# Altium schematic sheet top_Squad.SchDoc
size A4; SheetNumber: 1; SheetTotal: 7
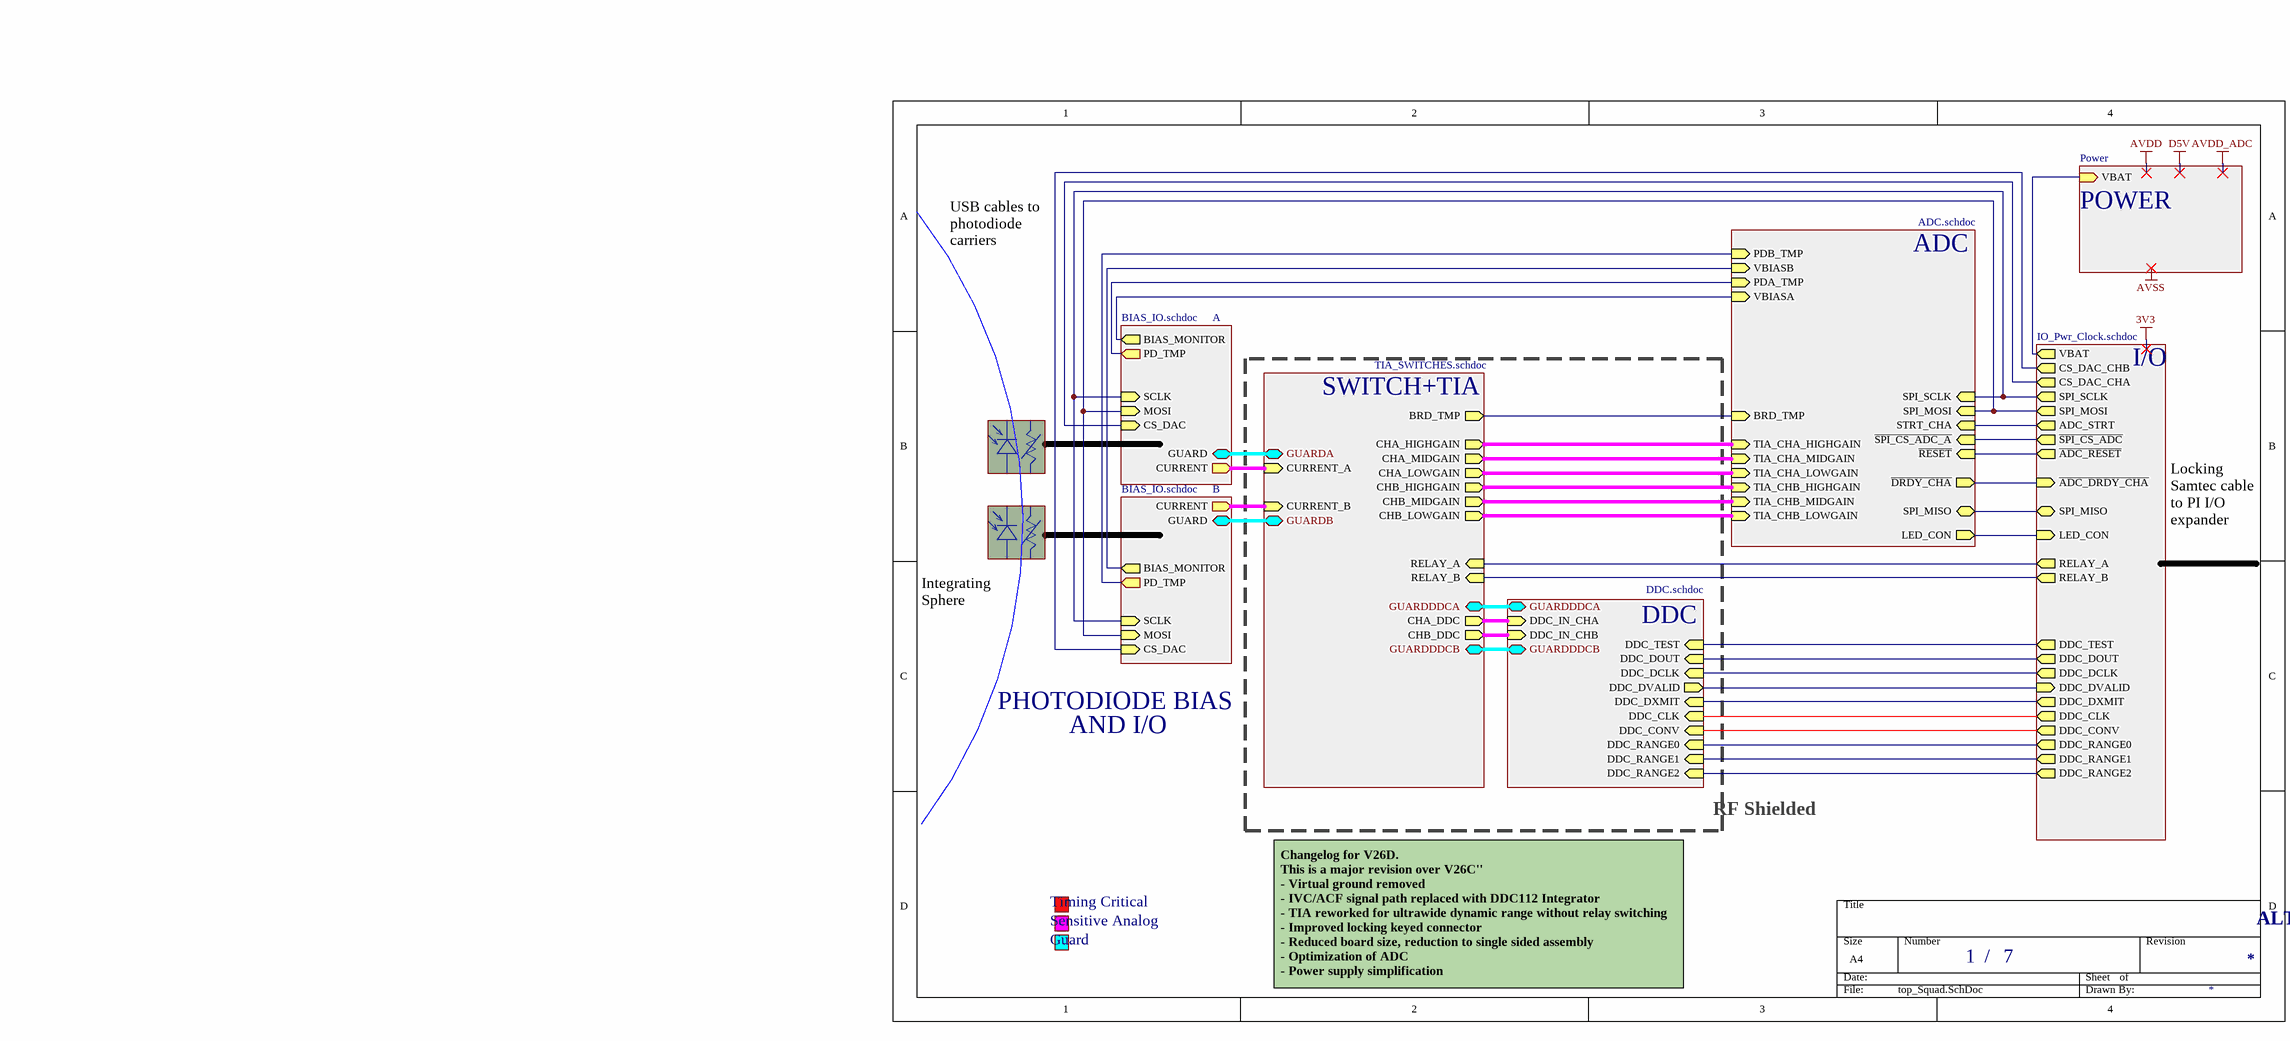
[diagram p0: top_Squad.SchDoc]

## Sub-sheets
A = BIAS_IO.schdoc: CURRENT (out), GUARD (bidir), BIAS_MONITOR (out), PD_TMP (out), SCLK (in), MOSI (in), CS_DAC (in)
ADC = ADC.schdoc: SPI_MISO (bidir), ~{DRDY_CHA} (out), ~{RESET} (in), ~{SPI_CS_ADC_A} (in), STRT_CHA (in), TIA_CHB_LOWGAIN (in), TIA_CHB_MIDGAIN (in), TIA_CHB_HIGHGAIN (in), TIA_CHA_LOWGAIN (in), TIA_CHA_MIDGAIN (in), TIA_CHA_HIGHGAIN (in), BRD_TMP (in), LED_CON (out), VBIASA (in), PDA_TMP (in), SPI_MOSI (in), SPI_SCLK (in), VBIASB (in), PDB_TMP (in)
B = BIAS_IO.schdoc: CURRENT (out), GUARD (bidir), MOSI (in), SCLK (in), CS_DAC (in), BIAS_MONITOR (out), PD_TMP (out)
DDC = DDC.schdoc: DDC_CONV (in), DDC_CLK (in), DDC_IN_CHA (in), DDC_IN_CHB (in), DDC_RANGE2 (in), DDC_RANGE0 (in), DDC_RANGE1 (in), DDC_DXMIT (in), DDC_DVALID (out), DDC_DCLK (in), DDC_DOUT (in), DDC_TEST (in), GUARDDDCA (bidir), GUARDDDCB (bidir)
I/O = IO_Pwr_Clock.schdoc: DDC_RANGE2 (out), DDC_RANGE1 (out), DDC_RANGE0 (out), DDC_CONV (out), DDC_CLK (out), DDC_DXMIT (out), DDC_DVALID (in), DDC_DCLK (out), DDC_DOUT (out), DDC_TEST (out), RELAY_A (out), RELAY_B (out), ~{ADC_DRDY_CHA} (in), ~{SPI_CS_ADC} (out), ~{ADC_RESET} (out), SPI_MISO (bidir), ADC_STRT (out), CS_DAC_CHA (out), VBAT (out), CS_DAC_CHB (out), LED_CON (in), SPI_MOSI (out), SPI_SCLK (out)
POWER = Power: VBAT (in)
SWITCH+TIA = TIA_SWITCHES.schdoc: CHB_HIGHGAIN (out), CHB_MIDGAIN (out), CHB_LOWGAIN (out), CHA_LOWGAIN (out), CHA_MIDGAIN (out), CHA_HIGHGAIN (out), CURRENT_A (in), CURRENT_B (in), CHB_DDC (out), CHA_DDC (out), RELAY_B (in), RELAY_A (in), GUARDDDCA (bidir), GUARDDDCB (bidir), GUARDB (bidir), GUARDA (bidir), BRD_TMP (out)

## Nets
(unnamed): sheet POWER/VBAT, sheet I/O/VBAT
(unnamed): sheet I/O/DDC_RANGE2, sheet DDC/DDC_RANGE2
(unnamed): sheet I/O/DDC_RANGE1, sheet DDC/DDC_RANGE1
(unnamed): sheet I/O/DDC_RANGE0, sheet DDC/DDC_RANGE0
(unnamed): sheet I/O/DDC_CONV, sheet DDC/DDC_CONV
(unnamed): sheet I/O/DDC_CLK, sheet DDC/DDC_CLK
(unnamed): sheet I/O/DDC_DXMIT, sheet DDC/DDC_DXMIT
(unnamed): sheet I/O/DDC_DVALID, sheet DDC/DDC_DVALID
(unnamed): sheet I/O/DDC_DCLK, sheet DDC/DDC_DCLK
(unnamed): sheet I/O/DDC_DOUT, sheet DDC/DDC_DOUT
(unnamed): sheet I/O/DDC_TEST, sheet DDC/DDC_TEST
(unnamed): sheet I/O/RELAY_A, sheet SWITCH+TIA/RELAY_A
(unnamed): sheet I/O/RELAY_B, sheet SWITCH+TIA/RELAY_B
(unnamed): sheet I/O/~{ADC_DRDY_CHA}, sheet ADC/~{DRDY_CHA}
(unnamed): sheet I/O/~{SPI_CS_ADC}, sheet ADC/~{SPI_CS_ADC_A}
(unnamed): sheet I/O/~{ADC_RESET}, sheet ADC/~{RESET}
(unnamed): sheet I/O/SPI_MISO, sheet ADC/SPI_MISO
(unnamed): sheet I/O/ADC_STRT, sheet ADC/STRT_CHA
(unnamed): sheet I/O/CS_DAC_CHA, sheet A/CS_DAC
(unnamed): sheet I/O/CS_DAC_CHB, sheet B/CS_DAC
(unnamed): sheet I/O/LED_CON, sheet ADC/LED_CON
(unnamed): sheet I/O/SPI_MOSI, sheet ADC/SPI_MOSI, sheet A/MOSI, sheet B/MOSI
(unnamed): sheet I/O/SPI_SCLK, sheet ADC/SPI_SCLK, sheet A/SCLK, sheet B/SCLK
(unnamed): sheet ADC/TIA_CHB_LOWGAIN, sheet SWITCH+TIA/CHB_LOWGAIN
(unnamed): sheet ADC/TIA_CHB_MIDGAIN, sheet SWITCH+TIA/CHB_MIDGAIN
(unnamed): sheet ADC/TIA_CHB_HIGHGAIN, sheet SWITCH+TIA/CHB_HIGHGAIN
(unnamed): sheet ADC/TIA_CHA_LOWGAIN, sheet SWITCH+TIA/CHA_LOWGAIN
(unnamed): sheet ADC/TIA_CHA_MIDGAIN, sheet SWITCH+TIA/CHA_MIDGAIN
(unnamed): sheet ADC/TIA_CHA_HIGHGAIN, sheet SWITCH+TIA/CHA_HIGHGAIN
(unnamed): sheet ADC/BRD_TMP, sheet SWITCH+TIA/BRD_TMP
(unnamed): sheet ADC/VBIASA, sheet A/BIAS_MONITOR
(unnamed): sheet ADC/PDA_TMP, sheet A/PD_TMP
(unnamed): sheet ADC/VBIASB, sheet B/BIAS_MONITOR
(unnamed): sheet ADC/PDB_TMP, sheet B/PD_TMP
(unnamed): sheet SWITCH+TIA/CURRENT_A, sheet A/CURRENT
(unnamed): sheet SWITCH+TIA/CURRENT_B, sheet B/CURRENT
(unnamed): sheet SWITCH+TIA/CHB_DDC, sheet DDC/DDC_IN_CHB
(unnamed): sheet SWITCH+TIA/CHA_DDC, sheet DDC/DDC_IN_CHA
(unnamed): sheet SWITCH+TIA/GUARDDDCA, sheet DDC/GUARDDDCA
(unnamed): sheet SWITCH+TIA/GUARDDDCB, sheet DDC/GUARDDDCB
(unnamed): sheet SWITCH+TIA/GUARDB, sheet B/GUARD
(unnamed): sheet SWITCH+TIA/GUARDA, sheet A/GUARD

## Notes on the sheet
- USB cables to photodiode carriers
- Locking Samtec cable to PI I/O expander
- Integrating Sphere
- PHOTODIODE BIAS
- AND I/O
- RF Shielded
- Timing Critical
- Sensitive Analog
- Guard
- Changelog for V26D.
  This is a major revision over V26C''
  - Virtual ground removed
  - IVC/ACF signal path replaced with DDC112 Integrator
  - TIA reworked for ultrawide dynamic range without relay switching
  - Improved locking keyed connector
  - Reduced board size, reduction to single sided assembly
  - Optimization of ADC
  - Power supply simplification
- /
- ALTAIR PhotoDiode ReadOut (PDRO) - Squad
- Labels drawn without touching a wire or pin: AVSS